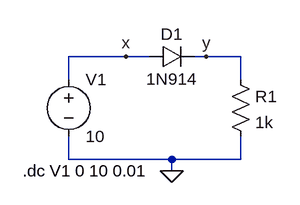
[diagram p0: schematic SILICON FWD_S20210020323.asc]
SILICON FWD_S20210020323.asc, the LTspice schematic file:
Version 4
SHEET 1 880 680
WIRE 128 80 48 80
WIRE 160 80 128 80
WIRE 240 80 224 80
WIRE 288 80 240 80
WIRE 48 112 48 80
WIRE 288 112 288 80
WIRE 48 224 48 192
WIRE 192 224 48 224
WIRE 288 224 288 192
WIRE 288 224 192 224
WIRE 192 240 192 224
FLAG 192 240 0
FLAG 128 80 x
FLAG 240 80 y
SYMBOL voltage 48 96 R0
SYMATTR InstName V1
SYMATTR Value 10
SYMBOL res 272 96 R0
SYMATTR InstName R1
SYMATTR Value 1k
SYMBOL diode 160 96 R270
WINDOW 0 32 32 VTop 2
WINDOW 3 0 32 VBottom 2
SYMATTR InstName D1
SYMATTR Value 1N914
TEXT -16 240 Left 2 !.dc V1 0 10 0.01

The netlist it stands for:
* SILICON FWD_S20210020323.asc
V1 x 0 10
R1 y 0 1k
D1 x y 1N914
.model D D
.lib standard.dio
.dc V1 0 10 0.01
.backanno
.end